# Altium schematic sheet Peripheral.SchDoc
size A3; SheetNumber: 5; SheetTotal: 6; ProjectTitle: DSP_VERSION_1.0
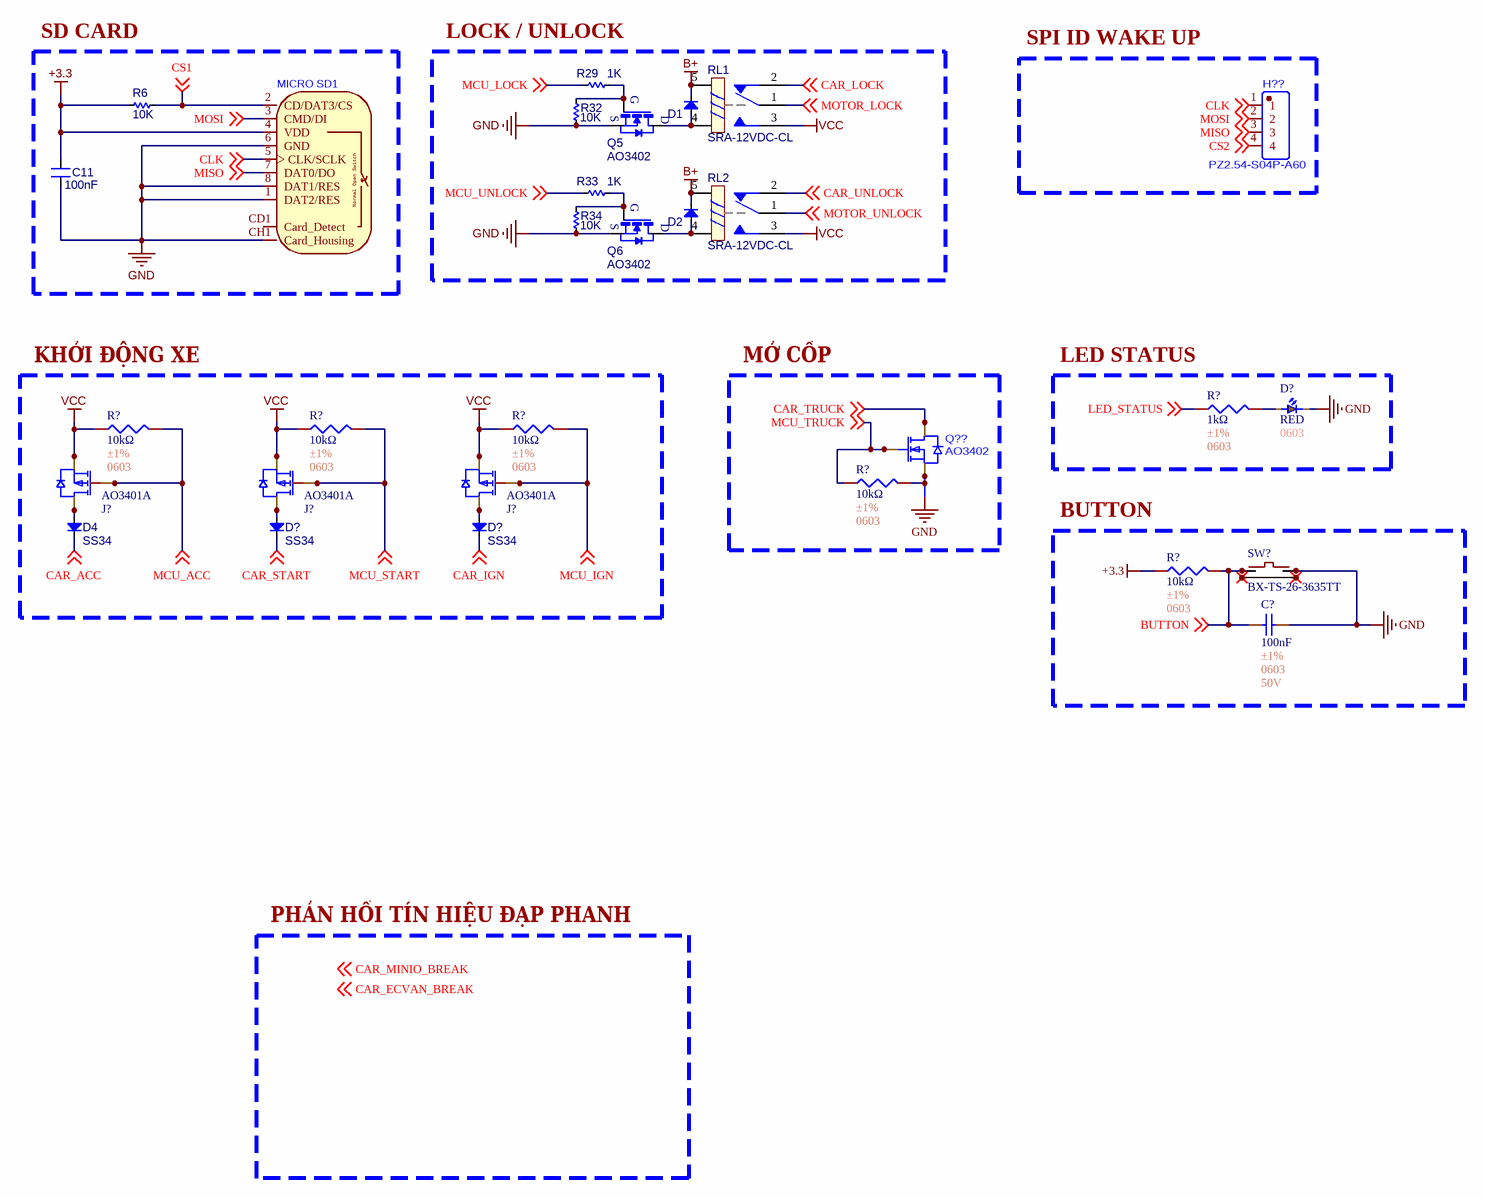
[diagram p0: Peripheral.SchDoc]

## Parts
(Parts that share a designator on the sheet are numbered #1, #2 ... from top to bottom, then left to right.)
C11  100nF  [C-0603]
C?  100nF  Tolerance: ±1%  Package: 0603  Voltage Rating: 50V  [C0603]
D1  1N5819  [SOD-323]  (value not drawn)
D2  1N5819  [SOD-323]  (value not drawn)
D4  SS34  [DIO-SMD-106]
D?#1  RED  Package: 0603  [LED0603]
D?#2  SS34  [DIO-SMD-106]
D?#3  SS34  [DIO-SMD-106]
H??  PZ2.54-S04P-A60  [J_4P_XH2.54]
J?#1  AO3401A  [AO3401]
J?#2  AO3401A  [AO3401]
J?#3  AO3401A  [AO3401]
MICRO_SD1  ATFFS150A01BR016  [USD(TFC-9P-1.XH(ATFFS150A01BR016))]  (value not drawn)
Q5  AO3402  [SOT23-3]
Q6  AO3402  [SOT23-3]
Q??  AO3402  [AO3402]
R6  10K  [RES-SMD-0603]
R29  1K  [RES-SMD-0603]
R32  10K  [RES-SMD-0603]
R33  1K  [RES-SMD-0603]
R34  10K  [RES-SMD-0603]
R?#1  1kΩ  Tolerance: ±1%  Package: 0603  [R0603]
R?#2  10kΩ  Tolerance: ±1%  Package: 0603  [R0603]
R?#3  10kΩ  Tolerance: ±1%  Package: 0603  [R0603]
R?#4  10kΩ  Tolerance: ±1%  Package: 0603  [R0603]
R?#5  10kΩ  Tolerance: ±1%  Package: 0603  [R0603]
R?#6  10kΩ  Tolerance: ±1%  Package: 0603  [R0603]
RL1  SRA-12VDC-CL  [YL318-DC12V-C]
RL2  SRA-12VDC-CL  [YL318-DC12V-C]
SW?  BX-TS-26-3635TT  [BX-TS-26-3635TT]

## Blocks framed on the sheet
SD CARD: C11 MICRO_SD1 R6
LOCK / UNLOCK: D1 D2 Q5 Q6 R29 R32-R34 RL1 RL2
SPI ID WAKE UP: H??
KHỞI ĐỘNG XE: D4 D?#2 D?#3 J?#1-J?#3 R?#2-R?#4
MỞ CỐP: Q?? R?#5
LED STATUS: D?#1 R?#1
BUTTON: C? R?#6 SW?

## Nets
+3.3: C11.2 MICRO_SD1.4(VDD) R6.1 R?#6.1
B+: D1.2(K) D2.2(K) RL1.5 RL2.5
GND: C11.1 C?.1 D?#1.1 MICRO_SD1.1(DAT2/RES) MICRO_SD1.6(GND) MICRO_SD1.8(DAT1/RES) MICRO_SD1.CH1(Card_Housing) Q5.2(S) Q6.2(S) Q??.2(S) R32.1 R34.1 R?#5.2 SW?.2
VCC: J?#1.2(S) J?#2.2(S) J?#3.2(S) R?#2.1 R?#3.1 R?#4.1 RL1.3 RL2.3
BUTTON: C?.2 R?#6.2 SW?.1 ; off-sheet BUTTON
CAR_ACC: D4.2(K) ; off-sheet CAR_ACC
CAR_IGN: D?#3.2(K) ; off-sheet CAR_IGN
CAR_LOCK: RL1.2 ; off-sheet CAR_LOCK
CAR_START: D?#2.2(K) ; off-sheet CAR_START
CAR_TRUCK: Q??.3(D) ; off-sheet CAR_TRUCK
CAR_UNLOCK: RL2.2 ; off-sheet CAR_UNLOCK
CLK: H??.1 MICRO_SD1.5(CLK/SCLK) ; off-sheet CLK
CS1: MICRO_SD1.2(CD/DAT3/CS) R6.2 ; off-sheet CS1
CS2: H??.4 ; off-sheet CS2
LED_STATUS: R?#1.1 ; off-sheet LED_STATUS
MCU_ACC: J?#1.1(G) R?#2.2 ; off-sheet MCU_ACC
MCU_IGN: J?#3.1(G) R?#4.2 ; off-sheet MCU_IGN
MCU_LOCK: R29.2 ; off-sheet MCU_LOCK
MCU_START: J?#2.1(G) R?#3.2 ; off-sheet MCU_START
MCU_TRUCK: Q??.1(G) R?#5.1 ; off-sheet MCU_TRUCK
MCU_UNLOCK: R33.2 ; off-sheet MCU_UNLOCK
MISO: H??.3 MICRO_SD1.7(DAT0/DO) ; off-sheet MISO
MOSI: H??.2 MICRO_SD1.3(CMD/DI) ; off-sheet MOSI
MOTOR_LOCK: RL1.1 ; off-sheet MOTOR_LOCK
MOTOR_UNLOCK: RL2.1 ; off-sheet MOTOR_UNLOCK
NetD1_1: D1.1(A) Q5.3(D) RL1.4
NetD2_1: D2.1(A) Q6.3(D) RL2.4
NetD4_1: D4.1(A) J?#1.3(D)
NetD?#1_2: D?#1.2 R?#1.2
NetD?#2_1: D?#2.1(A) J?#2.3(D)
NetD?#3_1: D?#3.1(A) J?#3.3(D)
NetQ5_1: Q5.1(G) R29.1 R32.2
NetQ6_1: Q6.1(G) R33.1 R34.2

Not connected (* = marked no-connect by the designer): MICRO_SD1 CD1(Card_Detect); SW? 3* 4*

## Notes on the sheet
- PHẢN HỒI TÍN HIỆU ĐẠP PHANH
- Labels drawn without touching a wire or pin: CAR_ECVAN_BREAK, CAR_MINIO_BREAK
- Author:
- Title:
- Size:
- A3
- Project:
- Revision:
- Modified Date:
- CheckedBy:
- Date:
- SW Version:
- (in symbol MICRO_SD) Normal Open Switch

## Library data of the parts
C11 = CM: Cap SMD; Value: 103
C? = C0603_100nF_±1%: Manufacturer: YAGEO; Mfr. Part #: CC0402FRNPO9BN100; LCSC Part #: C513681; Link: https://www.lcsc.com/product-detail/C513681.html?s_z=n_capital%2520yageo%252010pF%25200402; Capacitance: 100nF
D1 D2 D4 D?#2 D?#3 = Diode SMD: Default Diode; Code - JEDEC: DO-214-AB; Value: 1N5007; Published: 8-Jun-2000; Revision: July-2002: Re-released for DXP Platform.; Publisher: Altium Limited
D?#1 = D0603_RED: 25mcd~40mcd Water Clear -40℃~+85℃ 624nm Red 120° 60mW 0402 LED Indication - Discrete ROHS; Manufacturer: XINGLIGHT; Mfr. Part #: XL-1005UGC; Voltage - Forward(Vf): 3V; LCSC Part #: C965793; Power(Watts): 60mW; Link: https://www.lcsc.com/product-detail/C136765.html?s_z=n_LED%25200402%2520RED; Illumination Color: RED
H?? = J_4P_XH2.54: 1kV 1 2.54mm Pin Header 3A 2.5mm Through Hole 6mm -40℃~+105℃ 3mm Gold 4P Black 1x4P Through Hole,P=2.54mm Headers, Male Pins RoHS; Manufacturer: JXTCONN; MPN: PZ2.54-S04P-A60; LCSC Part #: C42431795; Packaging: Through Hole,P=2.54mm; Link: https://www.lcsc.com/product-detail/C42431795.html?s_z=n_q_t_header%25204%2520p&spm=wm.fly.bg.0.xh___wm.ssy.tc.0.tz&lcsc_vid=FlRcBlcDRFNZAlJQT1RZBVJSEVFcX11eRVQPBFEHFgAxVlNeQVVcV1RRRlFeUzsOAxUeFF5JWBYZEEoKFBINSQcJGk4dAgUUFAk%3D
J?#1-J?#3 = AO3401: 30V 4A 900mV@250uA 1 P-Channel SOT-23 MOSFETs ROHS; Manufacturer: AOS; Mfr. Part #: AO3401A; LCSC Part #: C15127; Package: SOT-23; Current - Continuous Drain(Id): 4A; Drain to Source Voltage: 30V; Link: https://www.lcsc.com/product-detail/C15127.html?s_z=n_AO3401
MICRO_SD1 = MICRO_SD: TFC-9P-1.5H(ATFFS150A01BR016)
Q5 Q6 = SI2302DS: N-Channel 20V 2.5A _Tc_ 830mW _Tc_ Surface Mount TO-236AB _SOT23_; MF: NXP Semiconductors; SnapEDA_Link: https://www.snapeda.com/parts/SI2302DS/NXP%20Semiconductors/view-part/4701514/?ref=snap; Availability: Unavailable; MP: SI2302DS; Price: None; Value: *; Package: None
Q?? = AO3402: MOSFET N-CH 30V SOT-23; Manufacturer: AOS; MPN: AO3402; LCSC Part #: C14385; Packaging: SOT-23; Link: https://www.lcsc.com/product-detail/C14385.html?s_z=n_q_ao3402&spm=wm.fly.bg.0.xh&lcsc_vid=FFlaVlZURFlbX1EAE1lbUlZfQwdeBlBRQ1VZBFdQQwUxVlNeRVZXVF1QQ1BYXzsOAxUeFF5JWBYZEEoKFBINSQcJGk4NBhADEA4cHktXR1FWSQwSGg0%3D
R6 R29 R32-R34 = Res-SMD: Resistor; Manufacturer: Generic Components; Class: Passive; Published: 08/06/2000; Publisher: Altium Hobart Technology Centre
R?#1 = R0603_1kΩ_±1%: 62.5mW Thick Film Resistor 50V ±1% ±200ppm/℃ 10Ω 0402 Chip Resistor - Surface Mount ROHS; Manufacturer: YAGEO; Mfr. Part #: RC0402FR-0710RL; LCSC Part #: C138066; Resistance: 1kΩ; Link: https://www.lcsc.com/product-detail/C138066.html?s_z=n_resistor%25200402%252010R
R?#2-R?#6 = R0603_10kΩ_±1%: 62.5mW Thick Film Resistor 50V ±1% ±200ppm/℃ 10Ω 0402 Chip Resistor - Surface Mount ROHS; Manufacturer: YAGEO; Mfr. Part #: RC0402FR-0710RL; LCSC Part #: C138066; Resistance: 10kΩ; Link: https://www.lcsc.com/product-detail/C138066.html?s_z=n_resistor%25200402%252010R
RL1 RL2 = Relay 1: Relay SPDT,10A - 12VDC 5 Pin; Value: Relay SPDT, 10A, 12V
SW? = BX-TS-26-3635TT: Without bracket 50mA 3.6mm 100000 Times 260gf 12V 3.5mm 3.5mm Rectangle button Standing paste SPST SMD,3x6mm Tactile Switches ROHS; Manufacturer: Bossie; Manufacture Part Number: C18078107; Packaging: Cut Tape; Link: https://www.lcsc.com/product-detail/Tactile-Switches_Bossie-BX-TS-26-3635TT_C18078107.html?s_z=n_tactile; Package: SMD,3x6mm